# Altium project MultiGenPI.PrjPcb
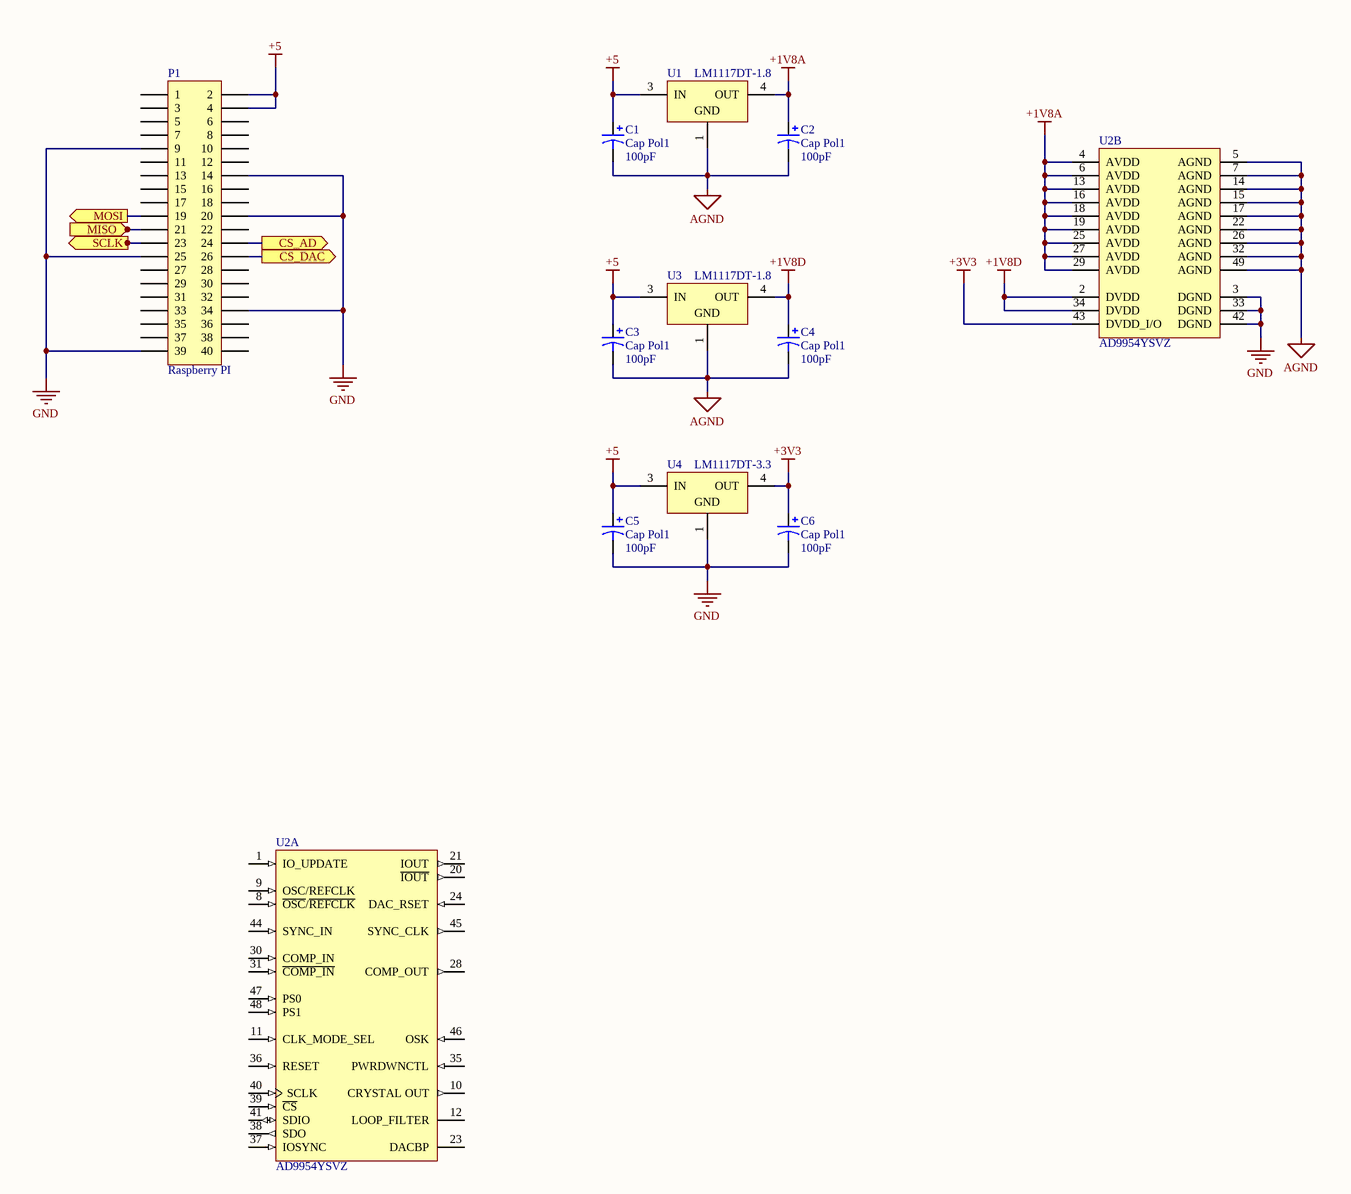
[diagram p0: MultiGenPI.SchDoc]
1 sheet, 11 parts. Net scope: flat (ports and power ports of the same name join across sheets).

## Sheet MultiGenPI.SchDoc
size A3

### Parts
C1  Cap Pol1  value 100pF  [RB7.6-15]
C2  Cap Pol1  value 100pF  [RB7.6-15]
C3  Cap Pol1  value 100pF  [RB7.6-15]
C4  Cap Pol1  value 100pF  [RB7.6-15]
C5  Cap Pol1  value 100pF  [RB7.6-15]
C6  Cap Pol1  value 100pF  [RB7.6-15]
P1  Raspberry PI  [HDR2X20]
U1  LM1117DT-1.8  [TD03B_N]
U2  AD9954YSVZ  [ADI-SV-48-4_N]  (parts A,B of 2)
U3  LM1117DT-1.8  [TD03B_N]
U4  LM1117DT-3.3  [TD03B_N]

### Ports
CS_AD (out), CS_DAC (out), MISO (in), MOSI (out), SCLK (out)

### Nets
+1V8A: C2.1 U1.4(OUT) U2.4(AVDD) U2.6(AVDD) U2.13(AVDD) U2.16(AVDD) U2.18(AVDD) U2.19(AVDD) U2.25(AVDD) U2.27(AVDD) U2.29(AVDD)
+1V8D: C4.1 U2.2(DVDD) U2.34(DVDD) U3.4(OUT)
+3V3: C6.1 U2.43(DVDD_I/O) U4.4(OUT)
+5: C1.1 C3.1 C5.1 P1.2 P1.4 U1.3(IN) U3.3(IN) U4.3(IN)
AGND: C1.2 C2.2 C3.2 C4.2 U1.1(GND) U2.5(AGND) U2.7(AGND) U2.14(AGND) U2.15(AGND) U2.17(AGND) U2.22(AGND) U2.26(AGND) U2.32(AGND) U2.49(AGND) U3.1(GND)
GND: C5.2 C6.2 P1.9 P1.14 P1.20 P1.25 P1.34 P1.39 U2.3(DGND) U2.33(DGND) U2.42(DGND) U4.1(GND)
NetP1_19: P1.19 ; port MOSI
NetP1_21: P1.21 ; port MISO
NetP1_23: P1.23 ; port SCLK
NetP1_24: P1.24 ; port CS_AD
NetP1_26: P1.26 ; port CS_DAC

Not connected (* = marked no-connect by the designer): P1 1 3 5 6 7 8 10 11 12 13 15 16 17 18 22 27 28 29 30 31 32 33 35 36 37 38 40; U2 1(IO_UPDATE) 8(~{OSC}/~{REFCLK}) 9(OSC/REFCLK) 10(CRYSTAL_OUT) 11(CLK_MODE_SEL) 12(LOOP_FILTER) 20(~{IOUT}) 21(IOUT) 23(DACBP) 24(DAC_RSET) 28(COMP_OUT) 30(COMP_IN) 31(~{COMP_IN}) 35(PWRDWNCTL) 36(RESET) 37(IOSYNC) 38(SDO) 39(~{CS}) 40(SCLK) 41(SDIO) 44(SYNC_IN) 45(SYNC_CLK) 46(OSK) 47(PS0) 48(PS1)

### Library data of the parts
C1-C6 = Cap Pol1: Polarized Capacitor (Radial); Published: 8-Jun-2000; LatestRevisionDate: 17-Jul-2002; LatestRevisionNote: Re-released for DXP Platform.; PackageReference: RB7.6-15; Publisher: Altium Limited; PackageDescription: Polarized Capacitor (Radial); 2 Leads
P1 = Header 20X2: Header, 20-Pin, Dual row; LatestRevisionDate: 17-Jul-2002; LatestRevisionNote: Re-released for DXP Platform.; Publisher: Altium Limited
U1 U3 = LM1117DT-1.8: 800mA Low-Dropout Linear Regulator, 3-pin TO-252; Manufacturer: National Semiconductor; PackageTopMarking: NSUZXYTT*LM1117*DT-1.8; PowerWise: N; CompType: LDO IC; High-Reliability: Y; DatasheetVersion: Apr-2006; PackageVersion: revD, Feb-2009; PackageReference: TD03B; PackageDescription: TO252, Molded, Jedec, 6.8 x 6.10 x 2.30mm Body, 3 Lead, 2.28mm Pitch, Surface Mount; PartNumber: LM1117DT-1.8; RoHS: N; PinCount: 3; Code_JEDEC: TO-252-AA; ComponentLink1Description: Manufacturer URL; ComponentLink1URL: http://www.national.com/; ComponentLink2Description: LM1117 Datasheet; ComponentLink2URL: http://www.national.com/ds/LM/LM1117.pdf; ComponentLink3Description: LM1117 Web Page; ComponentLink3URL: http://www.national.com/pf/LM/LM1117.html; ComponentLink4Description: TD03B Package Page; ComponentLink4URL: http://www.national.com/packaging/folders/td03b.html
U2 = AD9954YSVZ: 400 MSPS, 14-Bit, 1.8 V CMOS Direct Digital Synthesizer, Serial, SV-48-4, 250 Tray, Pb-Free; Master fclk: 400MHz; Resolution (Bits): 14bit; Tuning Word Width (bits): 32bit; REFCLK Multiplier: Yes; Compliance Range (V): 2.05V; FS Iout (mA nom): 10mA; DatasheetVersion: Rev. B; PackageVersion: 10/21/2005; PackageReference: SV-48-4; PackageDescription: 48-Lead Thin Quad Flat Package, Exposed Pad [TQFP_EP]; I/O Interface: Serial; Code_JEDEC: MS-026-ABC; ComponentLink1Description: Manufacturer URL; ComponentLink1URL: www.analog.com; ComponentLink2Description: Datasheet; ComponentLink2URL: http://www.analog.com/static/imported-files/data_sheets/AD9954.pdf; ComponentLink3Description: Package Specification; ComponentLink3URL: http://www.analog.com/static/imported-files/packages/PKG_PDF/TQFP_ED(SV)/SV_48_4.pdf
U4 = LM1117DT-3.3: 800mA Low-Dropout Linear Regulator, 3-pin TO-252; Manufacturer: National Semiconductor; PackageTopMarking: NSUZXYTT*LM1117*DT-3.3; PowerWise: N; CompType: LDO IC; High-Reliability: Y; DatasheetVersion: Apr-2006; PackageVersion: revD, Feb-2009; PackageReference: TD03B; PackageDescription: TO252, Molded, Jedec, 6.8 x 6.10 x 2.30mm Body, 3 Lead, 2.28mm Pitch, Surface Mount; PartNumber: LM1117DT-3.3; RoHS: N; PinCount: 3; Code_JEDEC: TO-252-AA; ComponentLink1Description: Manufacturer URL; ComponentLink1URL: http://www.national.com/; ComponentLink2Description: LM1117 Datasheet; ComponentLink2URL: http://www.national.com/ds/LM/LM1117.pdf; ComponentLink3Description: LM1117 Web Page; ComponentLink3URL: http://www.national.com/pf/LM/LM1117.html; ComponentLink4Description: TD03B Package Page; ComponentLink4URL: http://www.national.com/packaging/folders/td03b.html